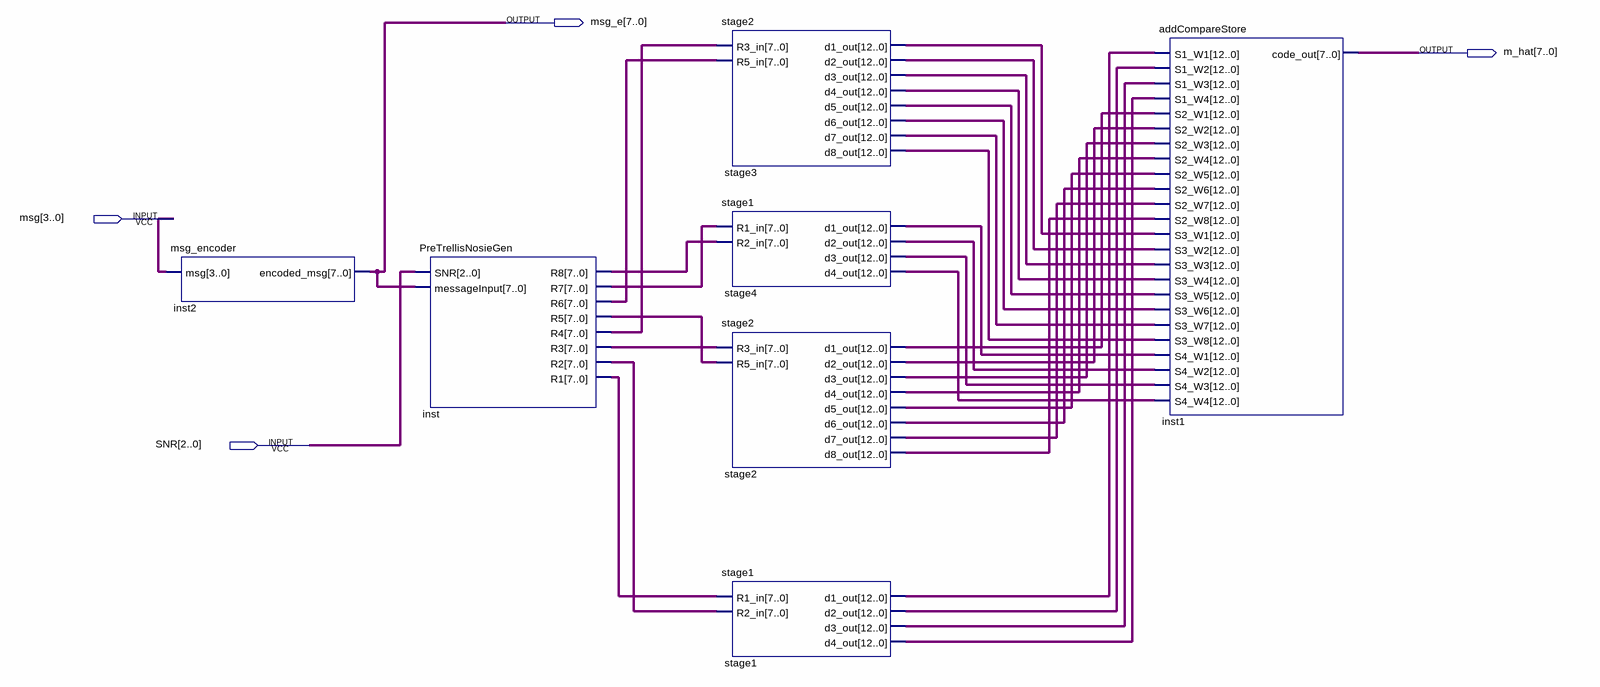
[diagram p0: schematic sheet]
// Quartus schematic TrellisTopLevel.bdf as structural Verilog: 7 symbols, 4 pins
module TrellisTopLevel (
  input  [3:0] msg,
  input  [2:0] SNR,
  output [7:0] msg_e,
  output [7:0] m_hat
);

  wire [7:0] inst_r1, inst_r2, inst_r3, inst_r4, inst_r5, inst_r6, inst_r7, inst_r8;
  wire [12:0] stage1_d1_out, stage1_d2_out, stage1_d3_out, stage1_d4_out, stage2_d1_out, stage2_d2_out,
       stage2_d3_out, stage2_d4_out, stage2_d5_out, stage2_d6_out, stage2_d7_out, stage2_d8_out,
       stage3_d1_out, stage3_d2_out, stage3_d3_out, stage3_d4_out, stage3_d5_out, stage3_d6_out,
       stage3_d7_out, stage3_d8_out, stage4_d1_out, stage4_d2_out, stage4_d3_out, stage4_d4_out;

  msg_encoder inst2 (.msg(msg), .encoded_msg(msg_e));
  PreTrellisNosieGen inst (
    .SNR(SNR), .messageInput(msg_e), .R8(inst_r8), .R7(inst_r7), .R6(inst_r6), .R5(inst_r5), .R4(inst_r4),
    .R3(inst_r3), .R2(inst_r2), .R1(inst_r1));
  stage2 stage3 (
    .R3_in(inst_r4), .R5_in(inst_r6), .d1_out(stage3_d1_out), .d2_out(stage3_d2_out), .d3_out(stage3_d3_out),
    .d4_out(stage3_d4_out), .d5_out(stage3_d5_out), .d6_out(stage3_d6_out), .d7_out(stage3_d7_out),
    .d8_out(stage3_d8_out));
  stage1 stage4 (
    .R1_in(inst_r7), .R2_in(inst_r8), .d1_out(stage4_d1_out), .d2_out(stage4_d2_out), .d3_out(stage4_d3_out),
    .d4_out(stage4_d4_out));
  stage2 stage2 (
    .R3_in(inst_r3), .R5_in(inst_r5), .d1_out(stage2_d1_out), .d2_out(stage2_d2_out), .d3_out(stage2_d3_out),
    .d4_out(stage2_d4_out), .d5_out(stage2_d5_out), .d6_out(stage2_d6_out), .d7_out(stage2_d7_out),
    .d8_out(stage2_d8_out));
  stage1 stage1 (
    .R1_in(inst_r1), .R2_in(inst_r2), .d1_out(stage1_d1_out), .d2_out(stage1_d2_out), .d3_out(stage1_d3_out),
    .d4_out(stage1_d4_out));
  addCompareStore inst1 (
    .S1_W1(stage1_d1_out), .S1_W2(stage1_d2_out), .S1_W3(stage1_d3_out), .S1_W4(stage1_d4_out),
    .S2_W1(stage2_d1_out), .S2_W2(stage2_d2_out), .S2_W3(stage2_d3_out), .S2_W4(stage2_d4_out),
    .S2_W5(stage2_d5_out), .S2_W6(stage2_d6_out), .S2_W7(stage2_d7_out), .S2_W8(stage2_d8_out),
    .S3_W1(stage3_d1_out), .S3_W2(stage3_d2_out), .S3_W3(stage3_d3_out), .S3_W4(stage3_d4_out),
    .S3_W5(stage3_d5_out), .S3_W6(stage3_d6_out), .S3_W7(stage3_d7_out), .S3_W8(stage3_d8_out),
    .S4_W1(stage4_d1_out), .S4_W2(stage4_d2_out), .S4_W3(stage4_d3_out), .S4_W4(stage4_d4_out),
    .code_out(m_hat));
endmodule
